# EasyEDA schematic Schematic_v1.1.json
TITLE: Raspberry Pi Power Monitor; REV: 1.1; Date: 2020-03-14; Sheet: 1/1; Drawn By: David00
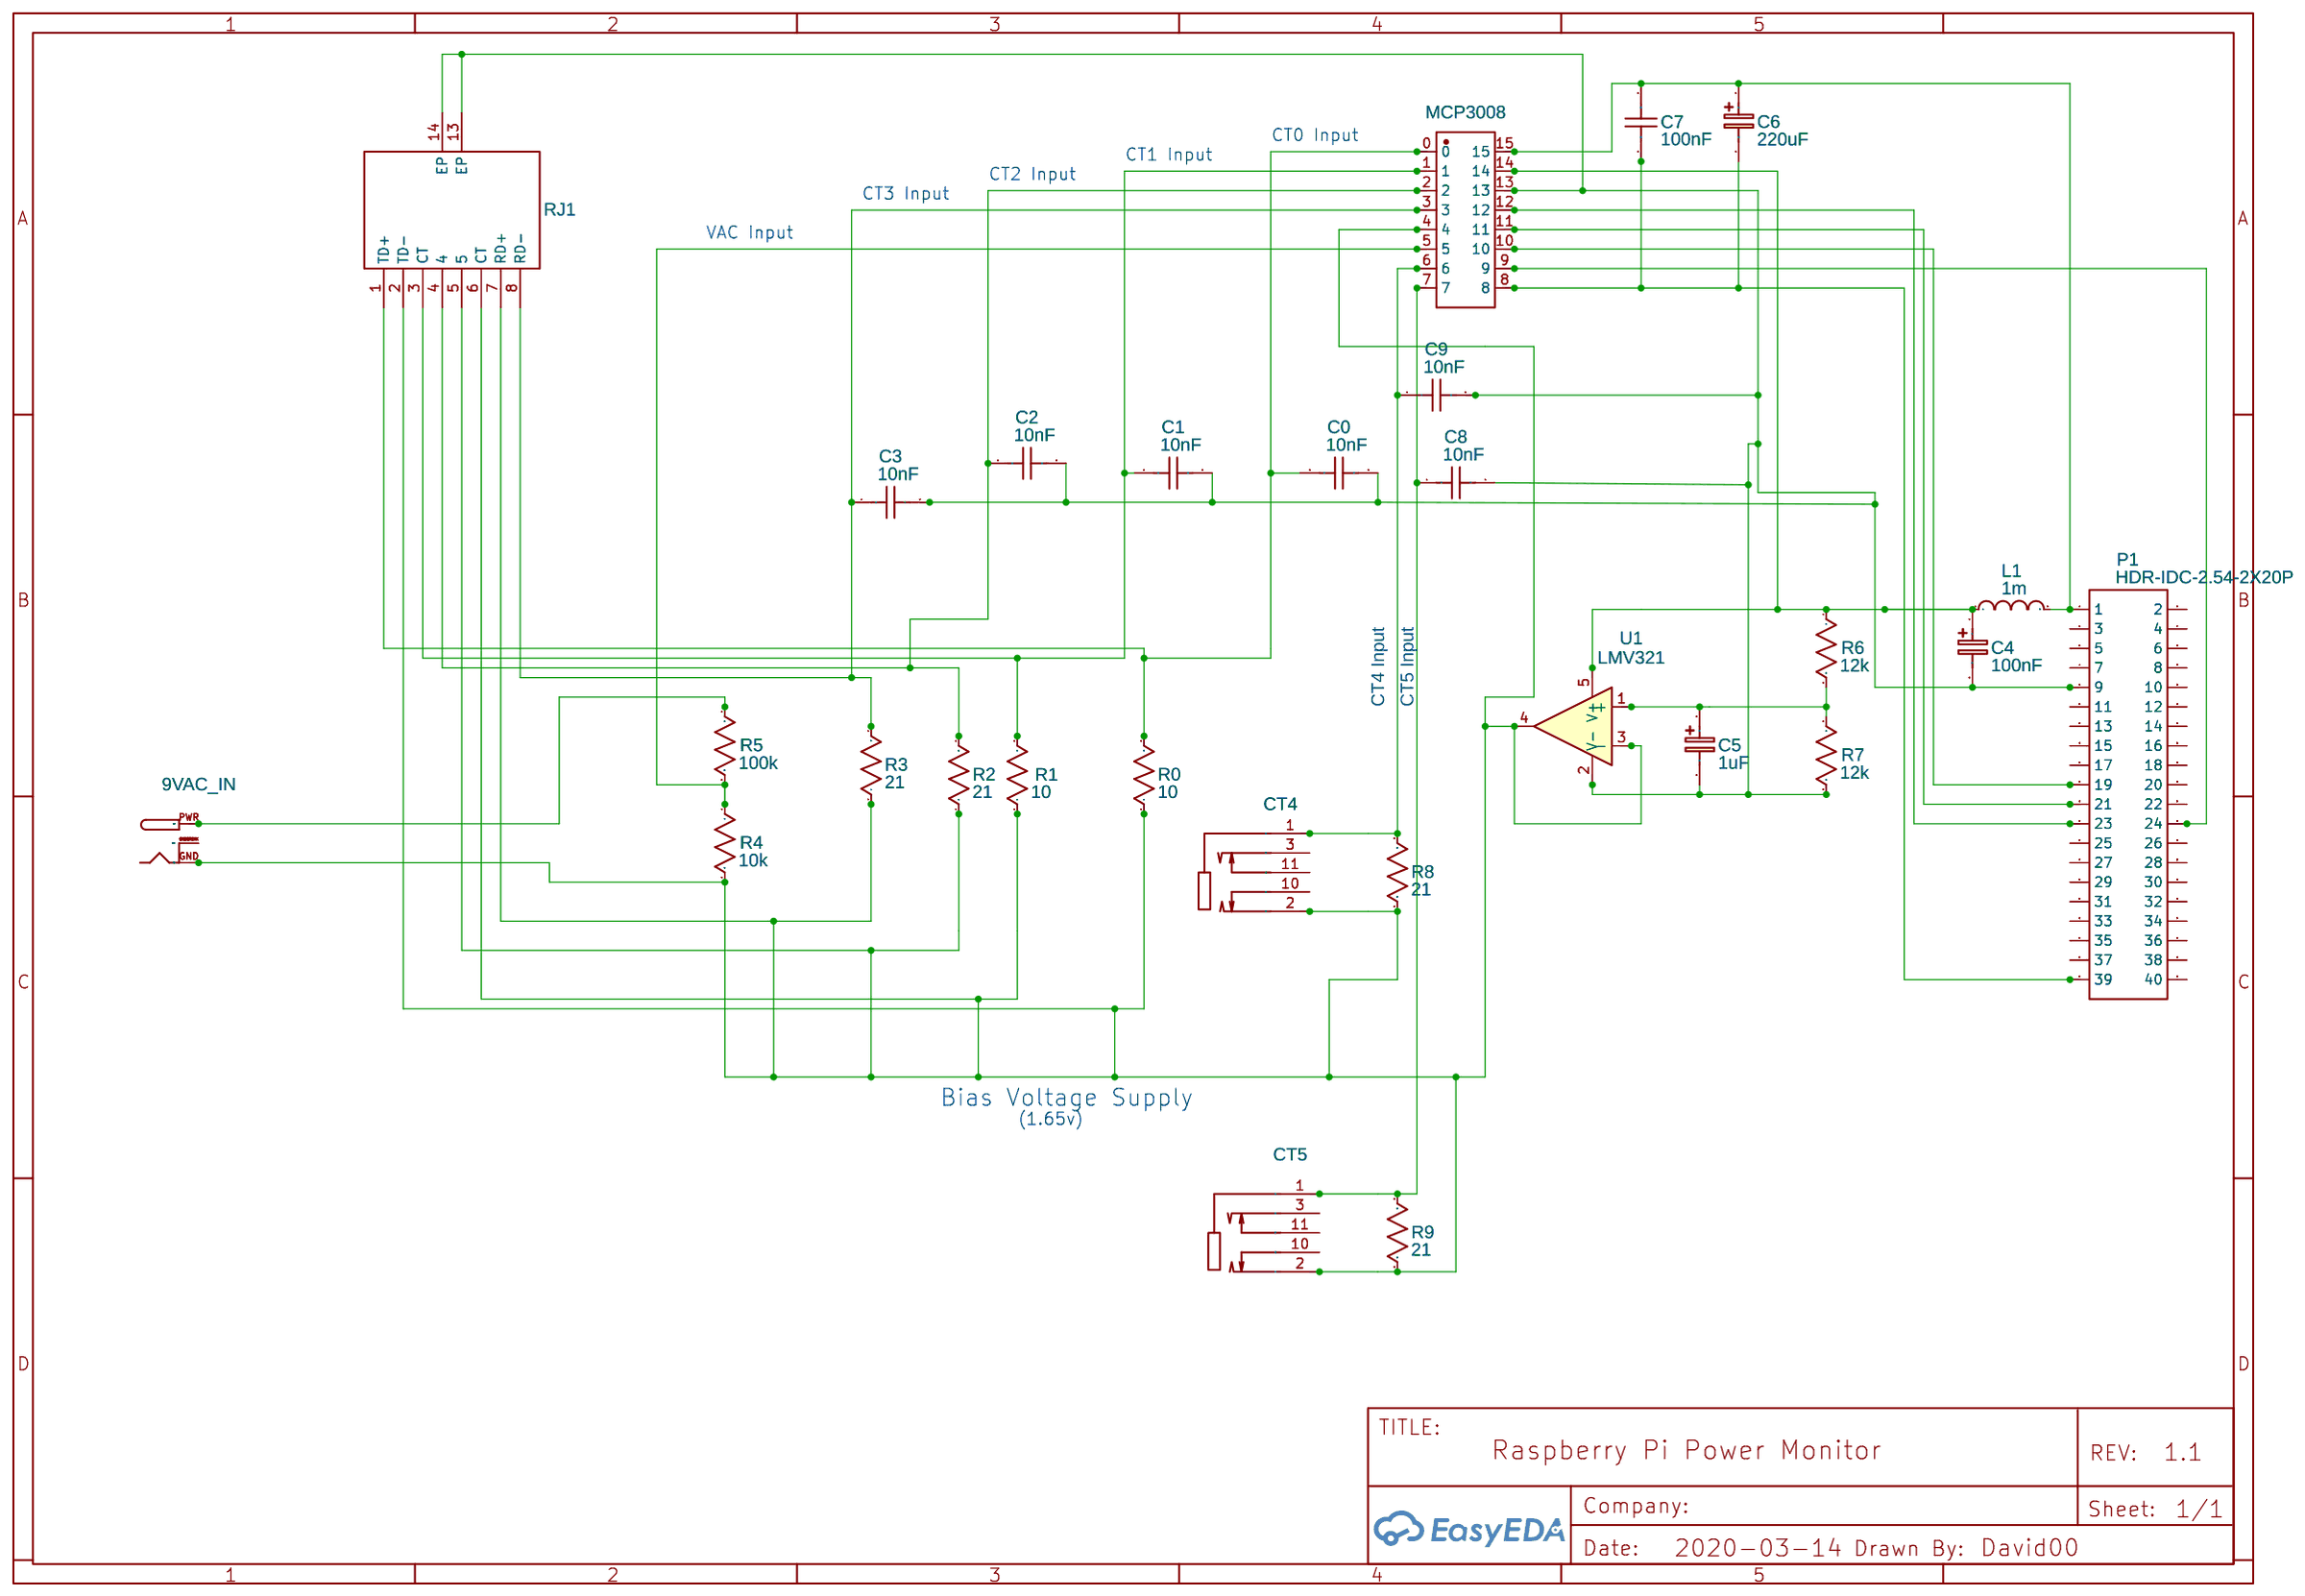
[diagram p0: schematic sheet]

## Parts
9VAC_IN  DCBARRELPTH  [DCJACK_2MM_PTH]
C0  10nF  [CAP-TH_L7.2-W2.5-P5.00-D0.5]
C1  10nF  [CAP-TH_L7.2-W2.5-P5.00-D0.5]
C2  10nF  [CAP-TH_L7.2-W2.5-P5.00-D0.5]
C3  10nF  [CAP-TH_L7.2-W2.5-P5.00-D0.5]
C4  100nF  [CAP-D3.0XF1.5]
C5  1uF  [CAP-D3.0XF1.5]
C6  220uF  [CAP-D3.0XF1.5]
C7  100nF  [CAP-TH_L6.5-W5.0-P5.00-D1.2]
C8  10nF  [CAP-TH_L7.2-W2.5-P5.00-D0.5]
C9  10nF  [CAP-TH_L7.2-W2.5-P5.00-D0.5]
CT4  PJ-328A0-B  [AUDIO-SMD_PJ-328A0-B]
CT5  PJ-328A0-B  [AUDIO-SMD_PJ-328A0-B]
L1  1m  [AXIAL-0.4]
MCP3008  IC seat 16P  [DIP-16_L20.3-W10.2-P2.54-LS10.2-BL]
P1  HDR-IDC-2.54-2X20P  [IDC-TH_40P-P2.54_C9138]
R0  10  [AXIAL-0.3]
R1  10  [AXIAL-0.3]
R2  21  [AXIAL-0.3]
R3  21  [AXIAL-0.3]
R4  10k  [AXIAL-0.3]
R5  100k  [AXIAL-0.3]
R6  12k  [AXIAL-0.3]
R7  12k  [AXIAL-0.3]
R8  21  [AXIAL-0.3]
R9  21  [AXIAL-0.3]
RJ1  13F-62ANWA2NL  [RJ45-TH_13F-62ANWA2NL]
U1  LMV321  [SOT-23-5]

## Library data of the parts
9VAC_IN = DCBARRELPTH: 2.0mm DC Barrel Jack; Contributor: Adafruit
C0-C3 C8 C9 = PE103J2A0501: Supplier: LCSC; Supplier Part: C390168; Manufacturer: KYET; Contributor: LCSC
C4-C6 = Cap_Electrolytic(TH)_D3.0XF1.5_EU: Contributor: EasyEDA
C7 = CC45SL3AD101JYVNA: Supplier: LCSC; Supplier Part: C342396; Manufacturer: TDK; Contributor: LCSC
CT4 CT5 = PJ-328A0-B: Supplier: LCSC; Supplier Part: C381129; Manufacturer: XKB Enterprise; Contributor: LCSC
L1 = Inductor_AXIAL-0.4_US
MCP3008 = IC seat 16P: Supplier: LCSC; Supplier Part: C2326; Manufacturer: Boom Precision Elec; Contributor: LCSC
P1 = HDR-IDC-2.54-2X20P: Supplier: LCSC; Manufacturer: BOOMELE; Manufacturer Part: IDC Box 2X20 2.54MM; image: //image.lceda.cn/szlcsc/C9138.jpg; Supplier Part: C9138
R0-R9 = Res_AXIAL-0.3(1/8W)_US
RJ1 = 13F-62ANWA2NL: Supplier: LCSC; Manufacturer: YDS; Contributor: LCSC; Supplier Part: C179761
U1 = LMV321: Contributor: KiCAD; license: https://www.gnu.org/licenses/lgpl-2.1.html

## Nets
Net-(9VAC_IN-GND): 9VAC_IN.GND CT4.2 CT5.2 MCP3008.4 R0.1 R1.1 R2.1 R3.1 R4.2 R8.1 R9.1 RJ1.2(TD-) RJ1.5 RJ1.6(CT) RJ1.7(RD+) U1.3(-) U1.4
Net-(9VAC_IN-PWR): 9VAC_IN.PWR R5.1
Net-(C0-1): C0.1 MCP3008.0 R0.2 RJ1.1(TD+)
Net-(C0-2): C0.2 C1.2 C2.2 C3.2 C4.2 C5.2 C8.2 C9.2 MCP3008.13 P1.9 R7.2 RJ1.13(EP) RJ1.14(EP) U1.2(V-)
Net-(C1-1): C1.1 MCP3008.1 R1.2 RJ1.3(CT)
Net-(C2-1): C2.1 MCP3008.2 R2.2 RJ1.4
Net-(C3-1): C3.1 MCP3008.3 R3.2 RJ1.8(RD-)
Net-(C4-1): C4.1 L1.1 MCP3008.14 R6.1 U1.5(V+)
Net-(C5-1): C5.1 R6.2 R7.1 U1.1(+)
Net-(C6-1): C6.1 C7.2 L1.2 MCP3008.15 P1.1
Net-(C6-2): C6.2 C7.1 MCP3008.8 P1.39
Net-(C8-1): C8.1 CT5.1 MCP3008.7 R9.2
Net-(C9-1): C9.1 CT4.1 MCP3008.6 R8.2
Net-(MCP3008-5): MCP3008.5 R4.1 R5.2
Net-(MCP3008-9): MCP3008.9 P1.24
Net-(MCP3008-10): MCP3008.10 P1.19
Net-(MCP3008-11): MCP3008.11 P1.21
Net-(MCP3008-12): MCP3008.12 P1.23

Not connected (* = marked no-connect by the designer): 9VAC_IN GNDBREAK; CT4 3 10 11; CT5 3 10 11; P1 2 3 4 5 6 7 8 10 11 12 13 14 15 16 17 18 20 22 25 26 27 28 29 30 31 32 33 34 35 36 37 38 40

## Notes on the sheet
- CT0 Input
- CT1 Input
- CT2 Input
- CT3 Input
- VAC Input
- CT4 Input
- CT5 Input
- Bias Voltage Supply
- (1.65v)
